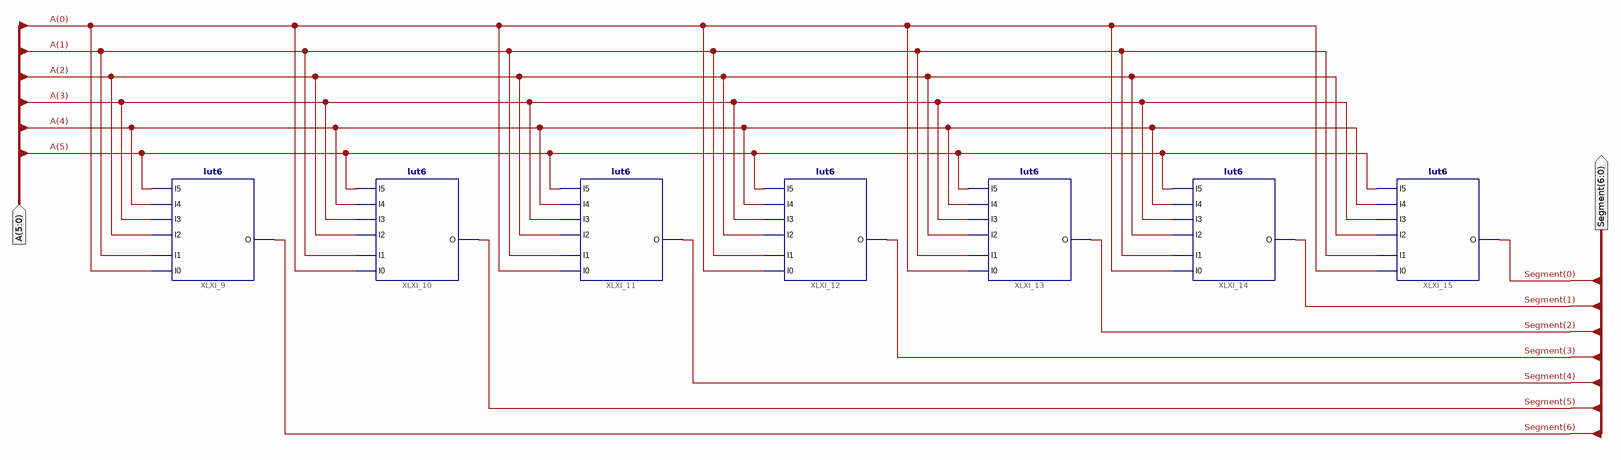
[diagram p0: schematic sheet 1]
// Xilinx ISE schematic ssd1da_9tb.sch (spartan6) as structural Verilog: 7 symbols, 2 ports
module ssd1da_9tb (
  input  [5:0] A,
  output [6:0] Segment
);

  lut6 #(.INIT("0000001BE38D84FB")) XLXI_9 (
    .O(Segment[6]), .I0(A[0]), .I1(A[1]), .I2(A[2]), .I3(A[3]), .I5(A[5]), .I4(A[4]));
  lut6 #(.INIT("0000001B895FECF7")) XLXI_10 (
    .O(Segment[5]), .I0(A[0]), .I1(A[1]), .I2(A[2]), .I3(A[3]), .I5(A[5]), .I4(A[4]));
  lut6 #(.INIT("0000000A2A3AFCBF")) XLXI_11 (
    .O(Segment[4]), .I0(A[0]), .I1(A[1]), .I2(A[2]), .I3(A[3]), .I5(A[5]), .I4(A[4]));
  lut6 #(.INIT("0000001B6B7C4A5E")) XLXI_12 (
    .O(Segment[3]), .I0(A[0]), .I1(A[1]), .I2(A[2]), .I3(A[3]), .I5(A[5]), .I4(A[4]));
  lut6 #(.INIT("0000001FD9B573CB")) XLXI_13 (
    .O(Segment[2]), .I0(A[0]), .I1(A[1]), .I2(A[2]), .I3(A[3]), .I5(A[5]), .I4(A[4]));
  lut6 #(.INIT("0000001CFBD1E3C9")) XLXI_14 (
    .O(Segment[1]), .I0(A[0]), .I1(A[1]), .I2(A[2]), .I3(A[3]), .I5(A[5]), .I4(A[4]));
  lut6 #(.INIT("0000001F6A07F075")) XLXI_15 (
    .O(Segment[0]), .I0(A[0]), .I1(A[1]), .I2(A[2]), .I3(A[3]), .I5(A[5]), .I4(A[4]));
endmodule
